# Altium schematic sheet TPS61165DBVR.schdoc
size 127 x 99 mm
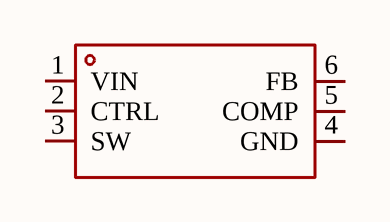
[diagram p0: TPS61165DBVR.schdoc]

## Parts
U?  TPS61165DBVR  [SOT-23-6_L2.9-W1.6-P0.95-LS2.8-BR]  (value not drawn)

## Nets

Not connected (* = marked no-connect by the designer): U? 1(VIN) 2(CTRL) 3(SW) 4(GND) 5(COMP) 6(FB)

## Library data of the parts
U? = TPS61165DBVR: Manufacturer: TI(德州仪器); Add into BOM: yes; Input Voltage: 3V~18V; Switch Frequency: 1.2MHz; Channels: 1; Output Voltage: 3V~38V; Output Current: 1.2A; Dimming: PWM; Topology: 升压; Symbol: TPS61165DBVR; Device: TPS61165DBVR; LCSC Part Name: TPS61165DBVR; Supplier Part: C58756; Manufacturer Part: TPS61165DBVR; Supplier Footprint: SOT-23-6; JLCPCB Part Class: Extended Part; Datasheet: https://www.ti.com/cn/lit/gpn/tps61165; Supplier: LCSC; Convert to PCB: yes; Type: DC-DC稳压器; Operating temperature: -40℃~+85℃